# EAGLE design Relay Board V5 (EAGLE 9.6.2)
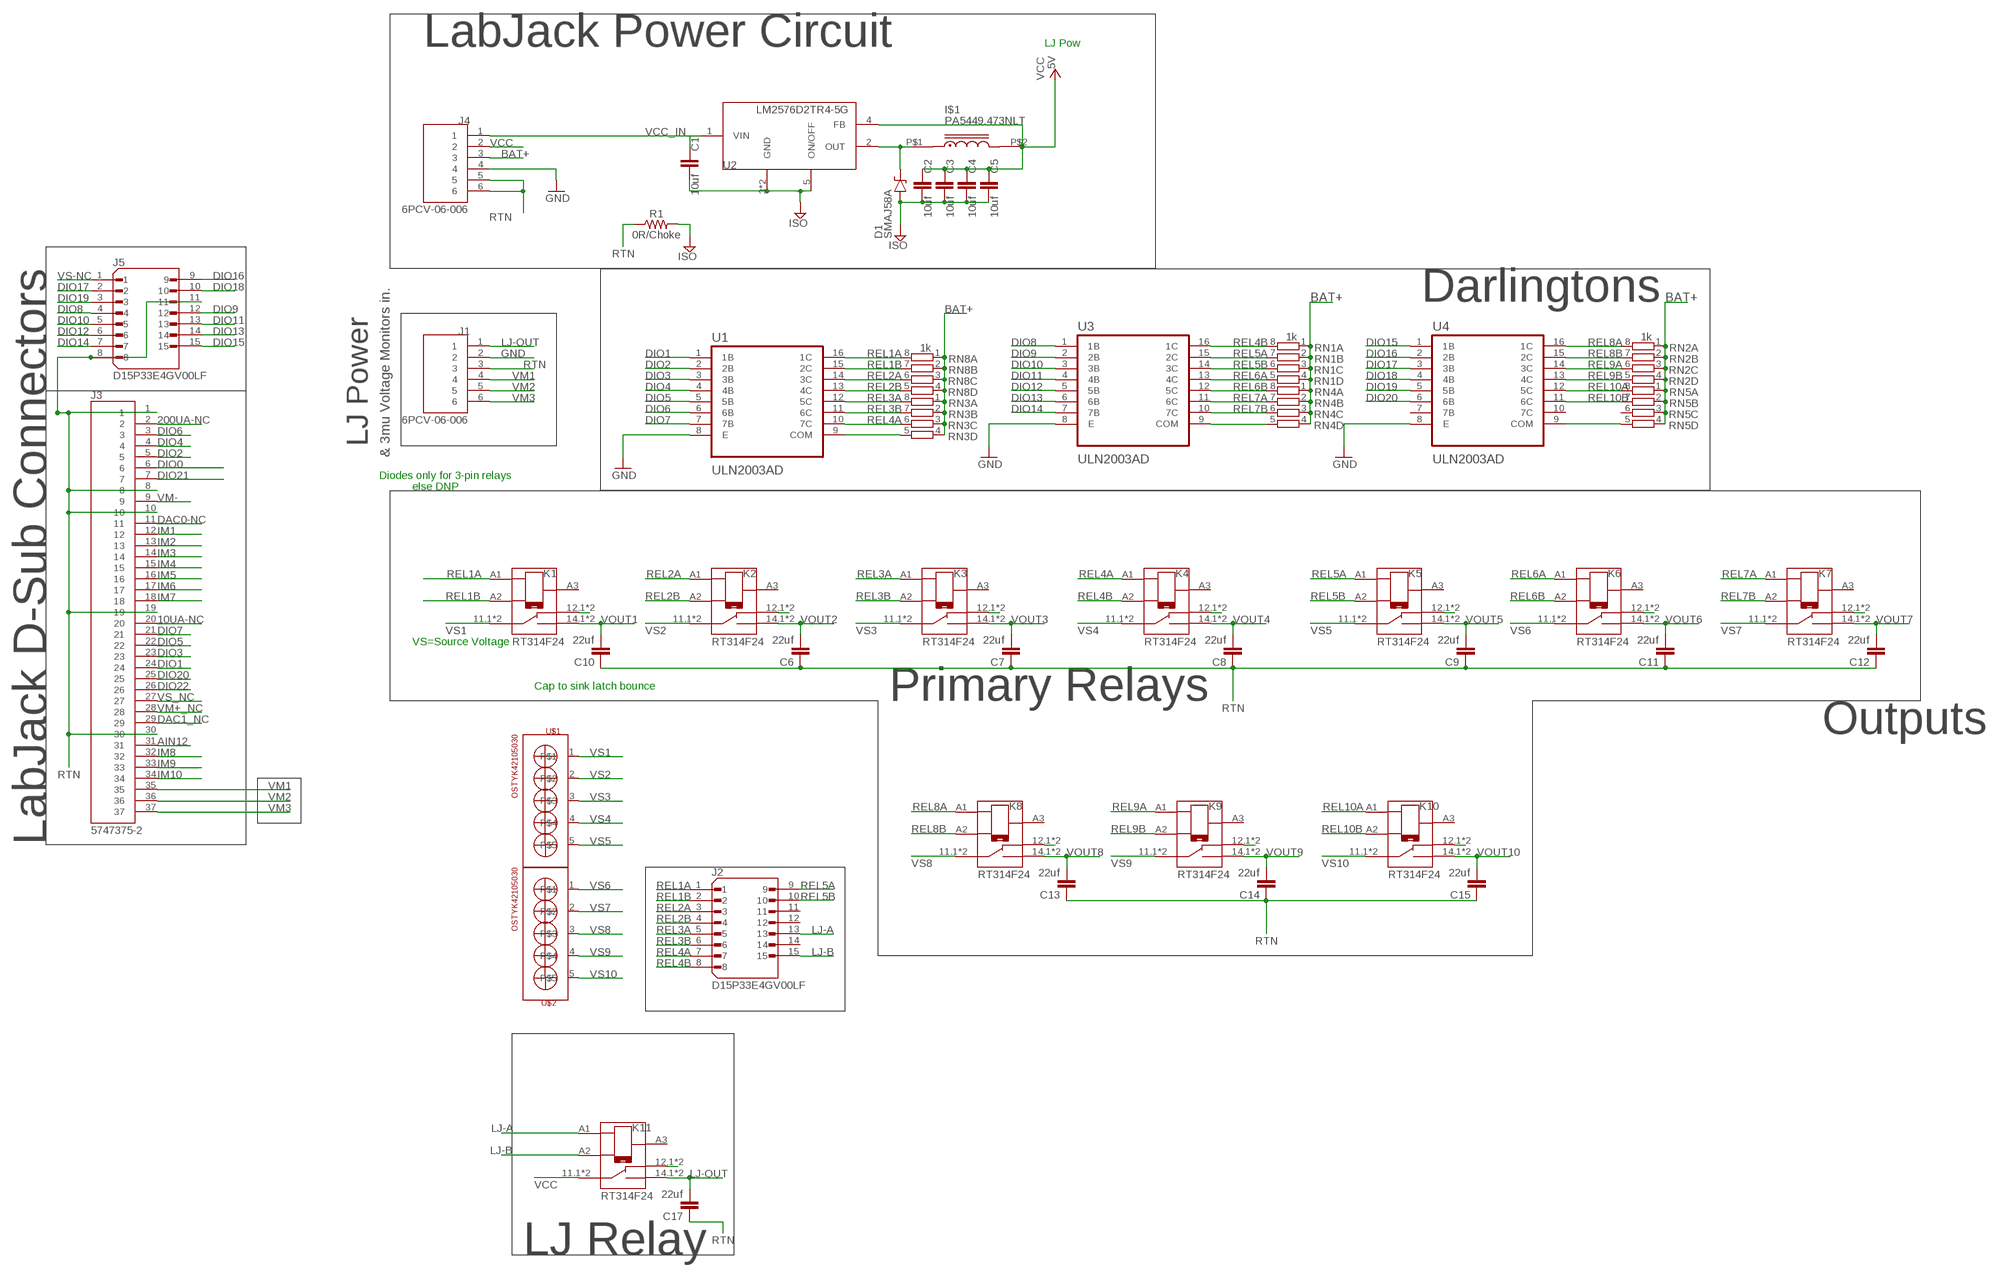
[diagram p0: schematic, sheet 1, part 1 of 2]
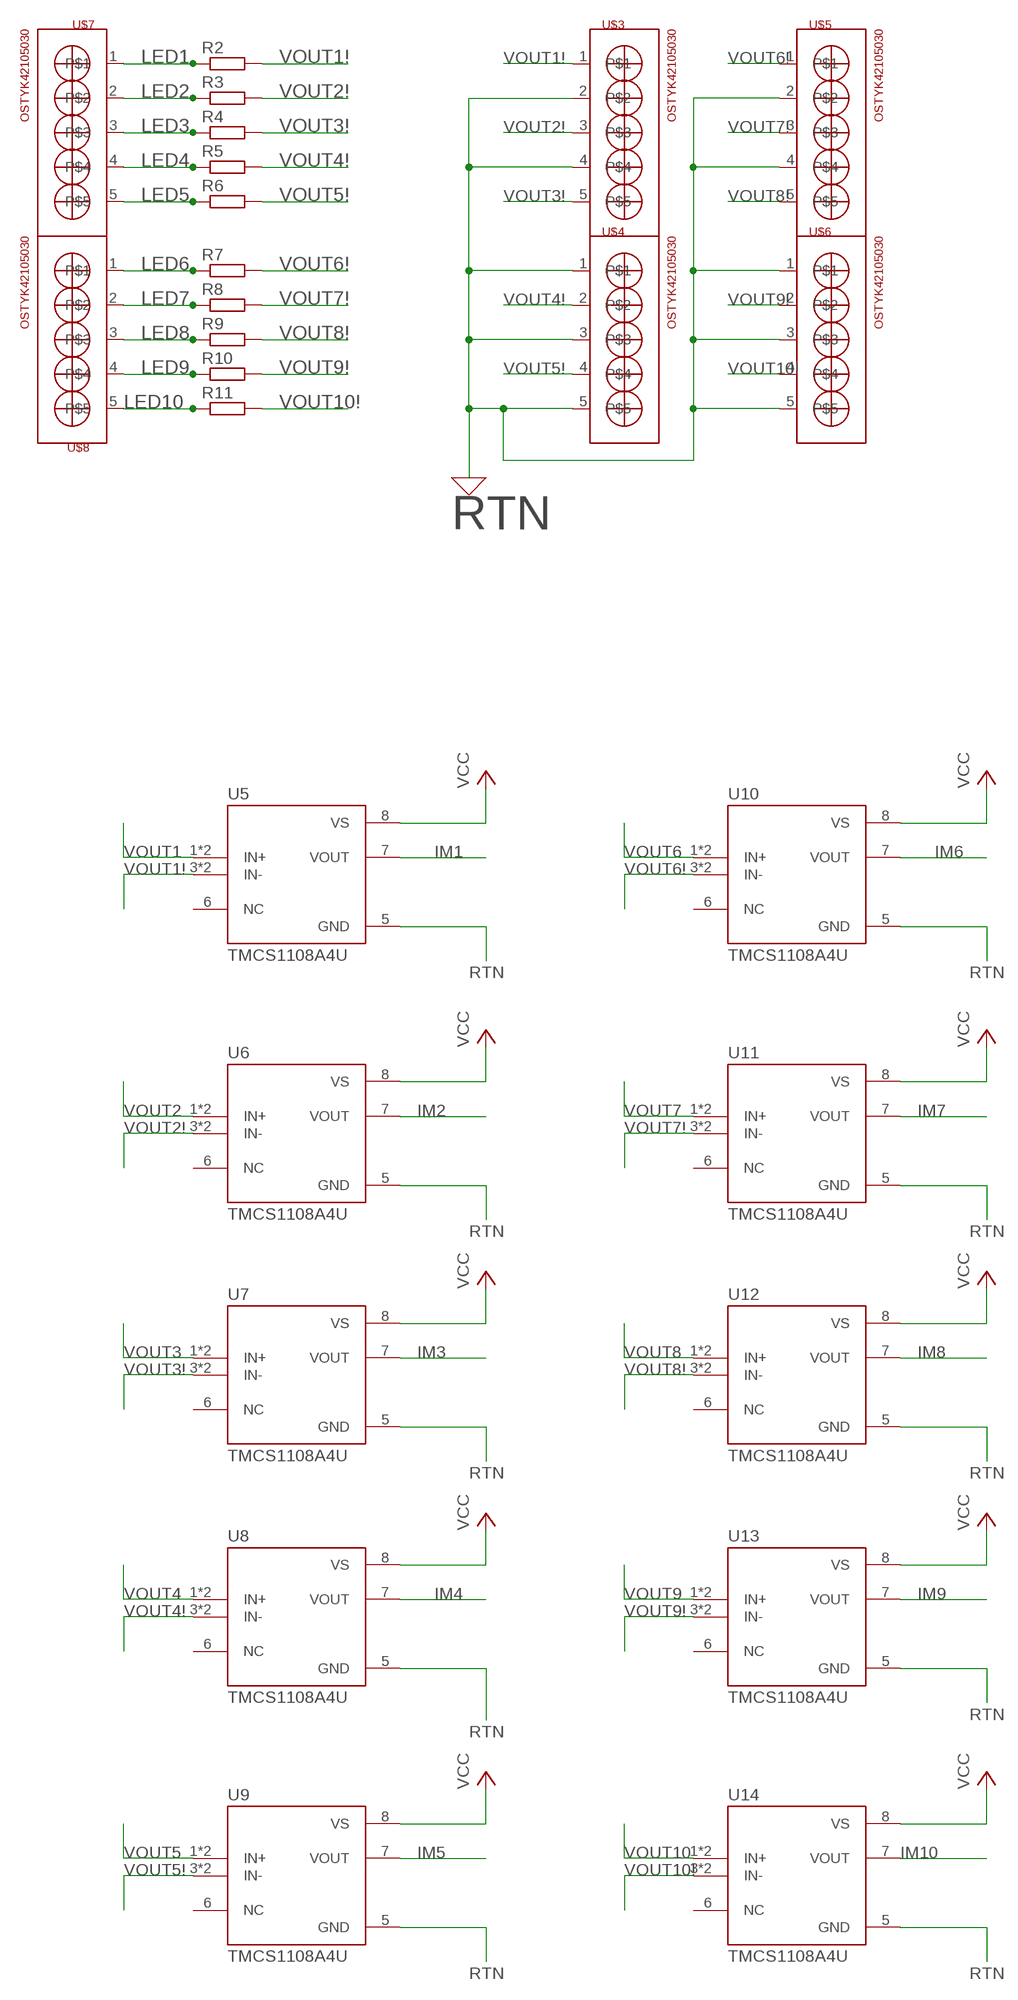
[diagram p1: schematic, sheet 1, part 2 of 2]

## Parts
C1  10uf  39NF-0805-50V-10%  [0805]
C2  10uf  39NF-0805-50V-10%  [0805]
C3  10uf  39NF-0805-50V-10%  [0805]
C4  10uf  39NF-0805-50V-10%  [0805]
C5  10uf  39NF-0805-50V-10%  [0805]
C6  22uf  5.6NF/5600PF_0603_50V_5%  [0603]
C7  22uf  5.6NF/5600PF_0603_50V_5%  [0603]
C8  22uf  5.6NF/5600PF_0603_50V_5%  [0603]
C9  22uf  5.6NF/5600PF_0603_50V_5%  [0603]
C10  22uf  5.6NF/5600PF_0603_50V_5%  [0603]
C11  22uf  5.6NF/5600PF_0603_50V_5%  [0603]
C12  22uf  5.6NF/5600PF_0603_50V_5%  [0603]
C13  22uf  5.6NF/5600PF_0603_50V_5%  [0603]
C14  22uf  5.6NF/5600PF_0603_50V_5%  [0603]
C15  22uf  5.6NF/5600PF_0603_50V_5%  [0603]
C17  22uf  5.6NF/5600PF_0603_50V_5%  [0603]
D1  SMAJ58A  [SMA]
I$1  PA5449.473NLT  PULSE_ELECTRONICS_INDUCTOR  [IND_TYS4020470M-10]
J1  6PCV-06-006  [TE_9-1437652-5]
J2  D15P33E4GV00LF  [AMPHENOL_D15P33E4GV00LF]
J3  5747375-2  [TE_5747375-2]
J4  6PCV-06-006  [TE_9-1437652-5]
J5  D15P33E4GV00LF  [AMPHENOL_D15P33E4GV00LF]
K1  RT314F24  8-1393239-8  [TE_8-1393239-8]
K2  RT314F24  8-1393239-8  [TE_8-1393239-8]
K3  RT314F24  8-1393239-8  [TE_8-1393239-8]
K4  RT314F24  8-1393239-8  [TE_8-1393239-8]
K5  RT314F24  8-1393239-8  [TE_8-1393239-8]
K6  RT314F24  8-1393239-8  [TE_8-1393239-8]
K7  RT314F24  8-1393239-8  [TE_8-1393239-8]
K8  RT314F24  8-1393239-8  [TE_8-1393239-8]
K9  RT314F24  8-1393239-8  [TE_8-1393239-8]
K10  RT314F24  8-1393239-8  [TE_8-1393239-8]
K11  RT314F24  8-1393239-8  [TE_8-1393239-8]
R1  0R/Choke  1.8MOHM  [0603]
R2  R-EU_0204/7  [0204/7]
R3  R-EU_0204/7  [0204/7]
R4  R-EU_0204/7  [0204/7]
R5  R-EU_0204/7  [0204/7]
R6  R-EU_0204/7  [0204/7]
R7  R-EU_0204/7  [0204/7]
R8  R-EU_0204/7  [0204/7]
R9  R-EU_0204/7  [0204/7]
R10  R-EU_0204/7  [0204/7]
R11  R-EU_0204/7  [0204/7]
RN1  1k  0016_064R_10K_/_CAY16-103J4LF  [CAY16]
RN2  1k  0016_064R_10K_/_CAY16-103J4LF  [CAY16]
RN3  1k  0016_064R_10K_/_CAY16-103J4LF  [CAY16]
RN4  1k  0016_064R_10K_/_CAY16-103J4LF  [CAY16]
RN5  1k  0016_064R_10K_/_CAY16-103J4LF  [CAY16]
RN8  1k  0016_064R_10K_/_CAY16-103J4LF  [CAY16]
U1  ULN2003AD  [SOIC127P600X175-16N]
U2  LM2576D2TR4-5G  [D2PAK-5]
U3  ULN2003AD  [SOIC127P600X175-16N]
U4  ULN2003AD  [SOIC127P600X175-16N]
U5  TMCS1108A4U  TMCS1108A3UQDRQ1  [SOIC127P599X175-8N]
U6  TMCS1108A4U  TMCS1108A3UQDRQ1  [SOIC127P599X175-8N]
U7  TMCS1108A4U  TMCS1108A3UQDRQ1  [SOIC127P599X175-8N]
U8  TMCS1108A4U  TMCS1108A3UQDRQ1  [SOIC127P599X175-8N]
U9  TMCS1108A4U  TMCS1108A3UQDRQ1  [SOIC127P599X175-8N]
U10  TMCS1108A4U  TMCS1108A3UQDRQ1  [SOIC127P599X175-8N]
U11  TMCS1108A4U  TMCS1108A3UQDRQ1  [SOIC127P599X175-8N]
U12  TMCS1108A4U  TMCS1108A3UQDRQ1  [SOIC127P599X175-8N]
U13  TMCS1108A4U  TMCS1108A3UQDRQ1  [SOIC127P599X175-8N]
U14  TMCS1108A4U  TMCS1108A3UQDRQ1  [SOIC127P599X175-8N]
U$1  OSTYK42105030  [OSTYK42105030]
U$2  OSTYK42105030  [OSTYK42105030]
U$3  OSTYK42105030  [OSTYK42105030]
U$4  OSTYK42105030  [OSTYK42105030]
U$5  OSTYK42105030  [OSTYK42105030]
U$6  OSTYK42105030  [OSTYK42105030]
U$7  OSTYK42105030  [OSTYK42105030]
U$8  OSTYK42105030  [OSTYK42105030]

## Nets
10UA-NC: J3.20
200UA-NC: J3.2
AGND: C1.2 C2.2 C3.2 C4.2 C5.2 D1.A R1.2 U2.3(GND) U2.5(ON/OFF) U2.6(GND) ; supply symbol labelled ISO
AIN12: J3.31
BAT+: J4.3 RN1.1 RN1.2 RN1.3 RN1.4 RN2.1 RN2.2 RN2.3 RN2.4 RN3.1 RN3.2 RN3.3 RN3.4 RN4.1 RN4.2 RN4.3 RN4.4 RN5.1 RN5.2 RN5.3 RN5.4 RN8.1 RN8.2 RN8.3 RN8.4
DAC0-NC: J3.11
DAC1_NC: J3.29
DIO0: J3.6
DIO1: J3.24 U1.1(1B)
DIO2: J3.5 U1.2(2B)
DIO3: J3.23 U1.3(3B)
DIO4: J3.4 U1.4(4B)
DIO5: J3.22 U1.5(5B)
DIO6: J3.3 U1.6(6B)
DIO7: J3.21 U1.7(7B)
DIO8: J5.4 U3.1(1B)
DIO9: J5.12 U3.2(2B)
DIO10: J5.5 U3.3(3B)
DIO11: J5.13 U3.4(4B)
DIO12: J5.6 U3.5(5B)
DIO13: J5.14 U3.6(6B)
DIO14: J5.7 U3.7(7B)
DIO15: J5.15 U4.1(1B)
DIO16: J5.9 U4.2(2B)
DIO17: J5.2 U4.3(3B)
DIO18: J5.10 U4.4(4B)
DIO19: J5.3 U4.5(5B)
DIO20: J3.25 U4.6(6B)
DIO21: J3.7
DIO22: J3.26
GND: J1.2 J4.4 U1.8(E) U3.8(E) U4.8(E)
IM1: J3.12 U5.7(VOUT)
IM2: J3.13 U6.7(VOUT)
IM3: J3.14 U7.7(VOUT)
IM4: J3.15 U8.7(VOUT)
IM5: J3.16 U9.7(VOUT)
IM6: J3.17 U10.7(VOUT)
IM7: J3.18 U11.7(VOUT)
IM8: J3.32 U12.7(VOUT)
IM9: J3.33 U13.7(VOUT)
IM10: J3.34 U14.7(VOUT)
LED1: R2.1 U$7.1
LED2: R3.1 U$7.2
LED3: R4.1 U$7.3
LED4: R5.1 U$7.4
LED5: R6.1 U$7.5
LED6: R7.1 U$8.1
LED7: R8.1 U$8.2
LED8: R9.1 U$8.3
LED9: R10.1 U$8.4
LED10: R11.1 U$8.5
LJ-A: J2.13 K11.A1
LJ-B: J2.15 K11.A2
LJ-OUT: C17.2 J1.1 K11.14.1 K11.14.2
N$1: K1.12.1 K1.12.2
N$2: RN3.5 U1.9(COM)
N$3: K2.12.1 K2.12.2
N$4: K3.12.1 K3.12.2
N$5: D1.C I$1.P$1 U2.2(OUT)
N$6: K4.12.1 K4.12.2
N$7: K5.12.1 K5.12.2
N$8: K6.12.1 K6.12.2
N$9: K7.12.1 K7.12.2
N$10: RN4.5 U3.9(COM)
N$11: K8.12.1 K8.12.2
N$12: K9.12.1 K9.12.2
N$13: K10.12.1 K10.12.2
N$14: RN5.5 U4.9(COM)
N$15: K11.12.1 K11.12.2
N$16: C1.1
REL1A: J2.1 K1.A1 RN8.8 U1.16(1C)
REL1B: J2.2 K1.A2 RN8.7 U1.15(2C)
REL2A: J2.3 K2.A1 RN8.6 U1.14(3C)
REL2B: J2.4 K2.A2 RN8.5 U1.13(4C)
REL3A: J2.5 K3.A1 RN3.8 U1.12(5C)
REL3B: J2.6 K3.A2 RN3.7 U1.11(6C)
REL4A: J2.7 K4.A1 RN3.6 U1.10(7C)
REL4B: J2.8 K4.A2 RN1.8 U3.16(1C)
REL5A: J2.9 K5.A1 RN1.7 U3.15(2C)
REL5B: J2.10 K5.A2 RN1.6 U3.14(3C)
REL6A: K6.A1 RN1.5 U3.13(4C)
REL6B: K6.A2 RN4.8 U3.12(5C)
REL7A: K7.A1 RN4.7 U3.11(6C)
REL7B: K7.A2 RN4.6 U3.10(7C)
REL8A: K8.A1 RN2.8 U4.16(1C)
REL8B: K8.A2 RN2.7 U4.15(2C)
REL9A: K9.A1 RN2.6 U4.14(3C)
REL9B: K9.A2 RN2.5 U4.13(4C)
REL10A: K10.A1 RN5.8 U4.12(5C)
REL10B: K10.A2 RN5.7 U4.11(6C)
RTN: C6.1 C7.1 C8.1 C9.1 C10.1 C11.1 C12.1 C13.1 C14.1 C15.1 C17.1 J1.3 J3.1 J3.8 J3.10 J3.19 J3.30 J4.5 J4.6 J5.8 J5.11 R1.1 U5.5(GND) U6.5(GND) U7.5(GND) U8.5(GND) U9.5(GND) U10.5(GND) U11.5(GND) U12.5(GND) U13.5(GND) U14.5(GND) U$3.2 U$3.4 U$4.1 U$4.3 U$4.5 U$5.2 U$5.4 U$6.1 U$6.3 U$6.5
VCC: C2.1 C3.1 C4.1 C5.1 I$1.P$2 J4.2 K11.11.1 K11.11.2 U2.4(FB) U5.8(VS) U6.8(VS) U7.8(VS) U8.8(VS) U9.8(VS) U10.8(VS) U11.8(VS) U12.8(VS) U13.8(VS) U14.8(VS)
VCC_IN: J4.1 U2.1(VIN)
VM1: J1.4 J3.35
VM2: J1.5 J3.36
VM3: J1.6 J3.37
VM+_NC: J3.28
VM-: J3.9
VOUT1: C10.2 K1.14.1 K1.14.2 U5.1(IN+) U5.2(IN+)
VOUT1!: R2.2 U5.3(IN-) U5.4(IN-) U$3.1
VOUT2: C6.2 K2.14.1 K2.14.2 U6.1(IN+) U6.2(IN+)
VOUT2!: R3.2 U6.3(IN-) U6.4(IN-) U$3.3
VOUT3: C7.2 K3.14.1 K3.14.2 U7.1(IN+) U7.2(IN+)
VOUT3!: R4.2 U7.3(IN-) U7.4(IN-) U$3.5
VOUT4: C8.2 K4.14.1 K4.14.2 U8.1(IN+) U8.2(IN+)
VOUT4!: R5.2 U8.3(IN-) U8.4(IN-) U$4.2
VOUT5: C9.2 K5.14.1 K5.14.2 U9.1(IN+) U9.2(IN+)
VOUT5!: R6.2 U9.3(IN-) U9.4(IN-) U$4.4
VOUT6: C11.2 K6.14.1 K6.14.2 U10.1(IN+) U10.2(IN+)
VOUT6!: R7.2 U10.3(IN-) U10.4(IN-) U$5.1
VOUT7: C12.2 K7.14.1 K7.14.2 U11.1(IN+) U11.2(IN+)
VOUT7!: R8.2 U11.3(IN-) U11.4(IN-) U$5.3
VOUT8: C13.2 K8.14.1 K8.14.2 U12.1(IN+) U12.2(IN+)
VOUT8!: R9.2 U12.3(IN-) U12.4(IN-) U$5.5
VOUT9: C14.2 K9.14.1 K9.14.2 U13.1(IN+) U13.2(IN+)
VOUT9!: R10.2 U13.3(IN-) U13.4(IN-) U$6.2
VOUT10: C15.2 K10.14.1 K10.14.2 U14.1(IN+) U14.2(IN+)
VOUT10!: R11.2 U14.3(IN-) U14.4(IN-) U$6.4
VS1: K1.11.1 K1.11.2 U$1.1
VS2: K2.11.1 K2.11.2 U$1.2
VS3: K3.11.1 K3.11.2 U$1.3
VS4: K4.11.1 K4.11.2 U$1.4
VS5: K5.11.1 K5.11.2 U$1.5
VS6: K6.11.1 K6.11.2 U$2.1
VS7: K7.11.1 K7.11.2 U$2.2
VS8: K8.11.1 K8.11.2 U$2.3
VS9: K9.11.1 K9.11.2 U$2.4
VS10: K10.11.1 K10.11.2 U$2.5
VS-NC: J5.1
VS_NC: J3.27
Unconnected: J2.11 J2.12 J2.14 K1.A3 K2.A3 K3.A3 K4.A3 K5.A3 K6.A3 K7.A3 K8.A3 K9.A3 K10.A3 K11.A3 RN5.6 U4.7(7B) U4.10(7C) U5.6(NC) U6.6(NC) U7.6(NC) U8.6(NC) U9.6(NC) U10.6(NC) U11.6(NC) U12.6(NC) U13.6(NC) U14.6(NC)

## Notes on the sheet
- LabJack Power Circuit | LJ Pow
- 5V
- LabJack D-Sub Connectors
- Darlingtons
- LJ Power
- & 3mu Voltage Monitors in.
- Diodes only for 3-pin relays
- else DNP
- VS=Source Voltage
- Cap to sink latch bounce
- Primary Relays | Outputs
- LJ Relay

## Library data of the parts
C1-C5 = SparkFun-Capacitors:39NF: 39nF ceramic capacitors A capacitor is a passive two-terminal electrical component used to store electrical energy temporarily in an electric field.; PROD_ID: CAP-15816; VALUE: 39nF
C6-C15 C17 = SparkFun-Capacitors:5.6NF/5600PF: 5.6nF/5600pF ceramic capacitors A capacitor is a passive two-terminal electrical component used to store electrical energy temporarily in an electric field.; PROD_ID: CAP-16058; VALUE: 5.6nF
D1 = SMAJ58A:SMAJ58A: Check prices <https://pricing.snapeda.com/parts/SMAJ58A/Littelfuse%20Inc./view-part?ref=eda>; AVAILABILITY: Good; DESCRIPTION: 93.6V Clamp 4.3A Ipp Tvs Diode Surface Mount DO-214AC (SMA); MF: Littelfuse Inc.; MP: SMAJ58A; PACKAGE: DO-214AC-214 Littelfuse Inc.; PRICE: None; PURCHASE-URL: https://pricing.snapeda.com/search/part/SMAJ58A/?ref=eda
I$1 = pulse_electronics_inductor:PULSE_ELECTRONICS_INDUCTOR
J1 J4 = 6PCV-06-006:6PCV-06-006: Check availability <https://pricing.snapeda.com/parts/6PCV-06-006/TE%20Connectivity/view-part?ref=eda>; AVAILABILITY: In Stock; COMMENT: 9-1437652-5; DESCRIPTION: Buchanan 6 Position 9.53 mm Pitch Single Row 12-22 AWG Tri-Barrier Strip; MF: TE Connectivity; MP: 6PCV-06-006; PACKAGE: None; PRICE: None; PURCHASE-URL: https://pricing.snapeda.com/search/part/6PCV-06-006/?ref=eda
J2 J5 = D15P33E4GV00LF:D15P33E4GV00LF: 15 Position D-Sub Plug, Male Pins Connector Check availability <https://pricing.snapeda.com/parts/D15P33E4GV00LF/Amphenol%20ICC/view-part?ref=eda>; AVAILABILITY: In Stock; DESCRIPTION: D-Sub Standard Board Mount Connector, Input Output Connectors, Signal 15 way Pin Right Angle, Solder US standard, 200 cycles, Harpoons + Female Screw UNC 4 - 40 + Elec cont., 1.6mm PCB thickness.; MF: Amphenol ICC; MP: D15P33E4GV00LF; PACKAGE: None; PRICE: None; PURCHASE-URL: https://pricing.snapeda.com/search/part/D15P33E4GV00LF/?ref=eda
J3 = db37:5747375-2: onn D-Subminiature PIN 37 POS 2.77mm Solder ST Thru-Hole 37 Terminal 1 Port Tube; COMMENT: 5747375-2; DESCRIPTION: D-SUB pin strip 180 ° Number of pins: 37 Print TE Connectivity AMPLIMITE HD-20 1 pc(s); DIGI-KEY_PART_NUMBER: A34071-ND; EU_ROHS_COMPLIANCE: Compliant; MF: TE Connectivity; MP: 5747375-2; PACKAGE: None; PURCHASE-URL: https://pricing.snapeda.com/search/part/5747375-2/?ref=eda
K1-K11 = 8-1393239-8:8-1393239-8: General Purpose Relay SPDT (1 Form C) 24VDC Coil Through Hole Check prices <https://pricing.snapeda.com/parts/RT314F24/TE%20Connectivity/view-part?ref=eda>; AVAILABILITY: In Stock; COMMENT: 8-1393239-8; DESCRIPTION: General Purpose Relay, Power PCB Relay RT1 Series, Power, Latching Dual Coil, SPDT, 24 VDC, 16 A; MF: TE Connectivity; MP: RT314F24; PACKAGE: None; PRICE: None; PURCHASE-URL: https://pricing.snapeda.com/search/part/RT314F24/?ref=eda
R1 = SparkFun-Resistors:1.8MOHM: 1.8 MOhms ±5% 0.1W, 1/10W Chip Resistor 0603; PROD_ID: RES-13994; VALUE: 1.8M
R2-R11 = rcl:R-EU_: RESISTOR, European symbol; SPICEPREFIX: R
RN1-RN5 RN8 = Resistenze:0016_064R_10K_/_CAY16-103J4LF: 10K 064 R; CASE: SMD_3,2x1,6; MONTHLY_USAGE: _____; PART_NUMBER: 064R_10K_/_CAY16-103J4LF; PRICE: _____; SUPPLIER: _____; TYPE: Resistenze; VALUE: 10k
U1 U3 U4 = ULN2003AD:ULN2003AD: Check availability <https://pricing.snapeda.com/parts/ULN2003AD/Texas%20Instruments/view-part?ref=eda>; AVAILABILITY: In Stock; DESCRIPTION: 50-V, 7-ch darlington transistor array, -20C to 70C; MF: Texas Instruments; MP: ULN2003AD; PACKAGE: SOIC-16 Texas Instruments; PRICE: None; PURCHASE-URL: https://pricing.snapeda.com/search/part/ULN2003AD/?ref=eda
U2 = LM2576D2TR4-5G:LM2576D2TR4-5G: http://octopart.com/lm2576d2tr4-5g-on+semiconductor-46514222 Check prices <https://pricing.snapeda.com/parts/LM2576D2TR4-5G/ON%20Semiconductor/view-part?ref=eda>; AVAILABILITY: In Stock; DESCRIPTION: Buck Switching Regulator IC Positive or Negative Fixed 5V 1 Output 3A TO-263-6, D²Pak (5 Leads + Tab), TO-263BA; MF: ON Semiconductor; MP: LM2576D2TR4-5G; PACKAGE: D2PAK-5 ON Semiconductor; PRICE: None; PURCHASE-URL: https://pricing.snapeda.com/search/part/LM2576D2TR4-5G/?ref=eda
U5-U14 = TMCS1108A3UQDRQ1:TMCS1108A3UQDRQ1: Check availability <https://pricing.snapeda.com/parts/TMCS1108A3UQDRQ1/Texas%20Instruments/view-part?ref=eda>; AVAILABILITY: In Stock; DESCRIPTION: AEC-Q100, ±100-V isolated Hall-effect current sensor with internal reference; MF: Texas Instruments; MP: TMCS1108A3UQDRQ1; PACKAGE: None; PRICE: None; PURCHASE-URL: https://pricing.snapeda.com/search/part/TMCS1108A3UQDRQ1/?ref=eda
U$1-U$8 = OSTYK42105030:OSTYK42105030: Check availability <https://pricing.snapeda.com/parts/OSTYK42105030/On%20Shore%20Technology%20Inc./view-part?ref=eda>; AVAILABILITY: In Stock; DESCRIPTION: 5 Circuit 0.325 (8.26mm) Barrier Block Connector, Screws with Captive Plate; MF: On Shore Technology Inc.; MP: OSTYK42105030; PACKAGE: None; PRICE: None; PURCHASE-URL: https://pricing.snapeda.com/search/part/OSTYK42105030/?ref=eda

## Board
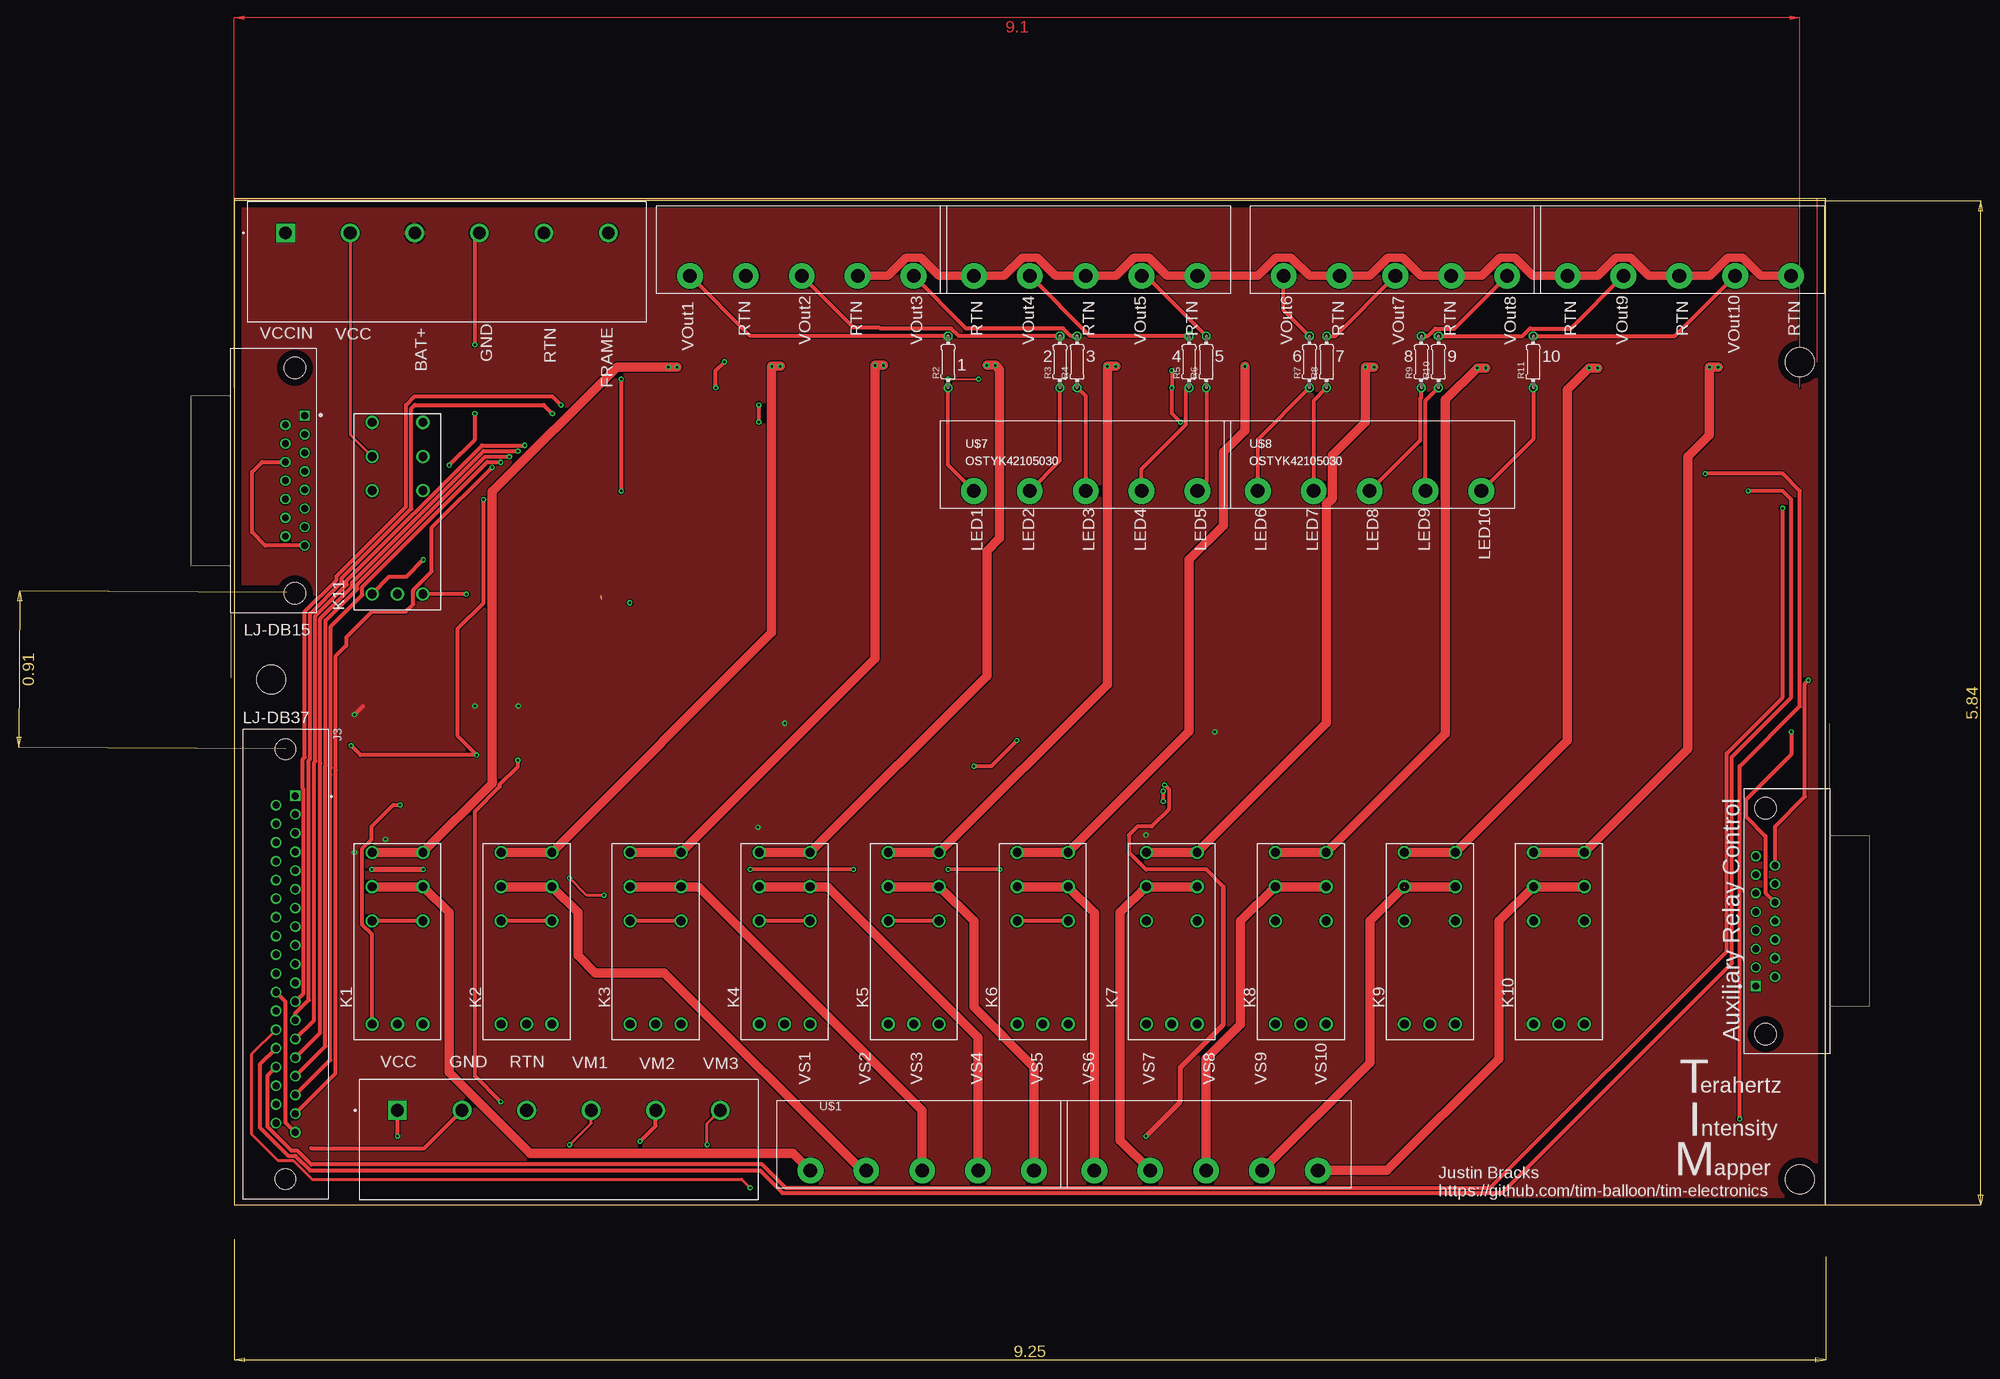
[diagram p2: board, top side]
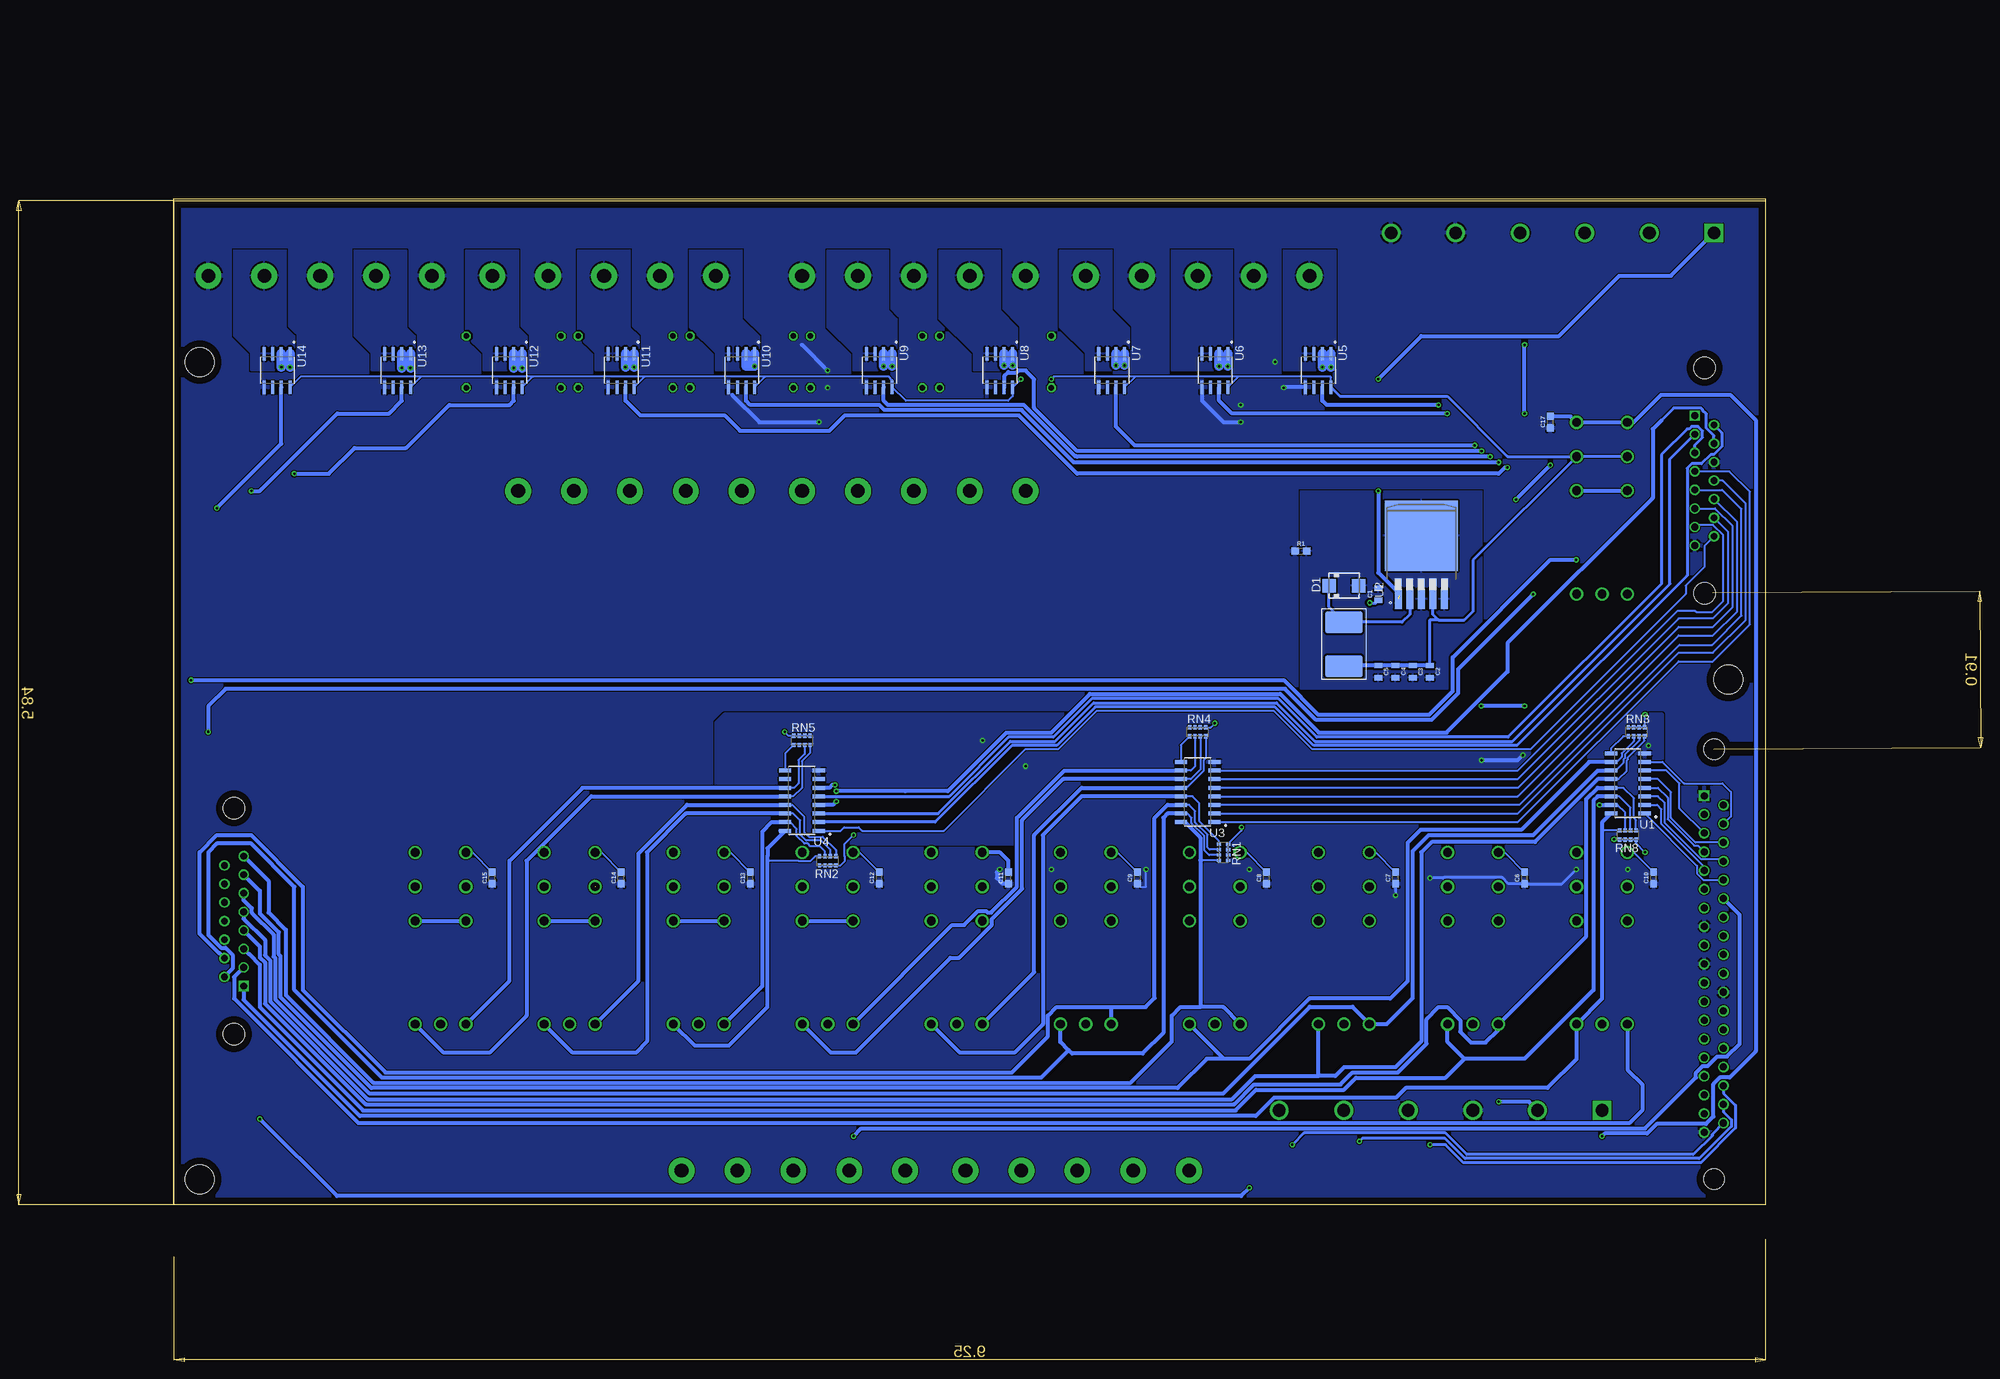
[diagram p3: board, bottom side, seen from below]

Size 234.95 x 148.59 mm. Coordinates in mm from the lower left corner, seen from the top.
Outline: 0,0 234.93,0 234.93,148.26 0,148.26
Outline: 0,0 0,148.59 234.95,148.59 234.95,0 0,0
Copper layers (1*16): Top 0.035mm / dielectric 1.5mm / Bottom 0.035mm
Design rules "default": minimum track width 6mil, minimum drill 0.35mm, track to track 6mil, track to pad 6mil, pad to pad 6mil, via to via 6mil, smd to smd 6mil, copper to edge 40mil, drill to drill 6mil, minimum pad ring 10mil, minimum via ring 8mil, stop-mask expansion 4mil, vias tented up to drill 0mil, thermal gap 10mil
Holes 4.32 mm at 231.14,3.81 231.14,124.46 5.46,77.6

### Footprints (pad centres in the part's own frame; a part is rotated, then mirrored left to right if it is on the bottom)
0805 = smd 0.8 x 1.2: 1 -0.9,0; 2 0.9,0
0603 = smd 1.1 x 1: 1 -0.85,0; 2 0.85,0
SMA = smd 2 x 2: A 2.2,0; C -2.2,0
IND_TYS4020470M-10 = smd 3.2 x 5.5: P$1 -3.5,0; P$2 3,0
TE_9-1437652-5 = drill 1.854 pad 2.204 square: 1 0,0 | drill 1.854 pad 2.204: 2 9.53,0; 3 19.06,0; 4 28.59,0; 5 38.12,0; 6 47.65,0
AMPHENOL_D15P33E4GV00LF = drill 1 square: 1 -9.59,1.42 | drill 1: 2 -6.85,1.42; 3 -4.11,1.42; 4 -1.37,1.42; 5 1.37,1.42; 6 4.11,1.42; 7 6.85,1.42; 8 9.59,1.42; 9 -8.22,-1.42; 10 -5.48,-1.42; 11 -2.74,-1.42; 12 0,-1.42; 13 2.74,-1.42; 14 5.48,-1.42; 15 8.22,-1.42 | hole 3.2: -16.66,0; 16.66,0
TE_5747375-2 = drill 1.04 square: 1 -24.84,1.42 | drill 1.04: 2 -22.1,1.42; 3 -19.33,1.42; 4 -16.56,1.42; 5 -13.82,1.42; 6 -11.05,1.42; 7 -8.28,1.42; 8 -5.54,1.42; 9 -2.77,1.42; 10 0,1.42; 11 2.77,1.42; 12 5.54,1.42; 13 8.28,1.42; 14 11.05,1.42; 15 13.82,1.42; 16 16.56,1.42; 17 19.33,1.42; 18 22.1,1.42; 19 24.84,1.42; 20 -23.47,-1.42; 21 -20.7,-1.42; 22 -17.96,-1.42; 23 -15.19,-1.42; 24 -12.42,-1.42; 25 -9.68,-1.42; 26 -6.91,-1.42; 27 -4.14,-1.42; 28 -1.4,-1.42; 29 1.4,-1.42; 30 4.14,-1.42; 31 6.91,-1.42; 32 9.68,-1.42; 33 12.42,-1.42; 34 15.19,-1.42; 35 17.96,-1.42; 36 20.7,-1.42; 37 23.47,-1.42 | hole 3.05: -31.75,0; 31.75,0
TE_8-1393239-8 = drill 1.3: 11.1 0,-3.75; 11.2 0,3.75; 12.1 -5.04,-3.75; 12.2 -5.04,3.75; 14.1 5.04,-3.75; 14.2 5.04,3.75; A1 -20.3,-3.75; A2 -20.3,3.75; A3 -20.3,0
0204/7 = drill 0.813 octagon: 1 -3.81,0; 2 3.81,0
CAY16 = smd 0.5 x 0.65: 1 -1.2,-0.675; 2 -0.4,-0.675; 3 0.4,-0.675; 4 1.2,-0.675; 5 1.2,0.675; 6 0.4,0.675; 7 -0.4,0.675; 8 -1.2,0.675
SOIC127P600X175-16N = smd 1.97 x 0.6: 1 -2.475,4.445; 2 -2.475,3.175; 3 -2.475,1.905; 4 -2.475,0.635; 5 -2.475,-0.635; 6 -2.475,-1.905; 7 -2.475,-3.175; 8 -2.475,-4.445; 9 2.475,-4.445; 10 2.475,-3.175; 11 2.475,-1.905; 12 2.475,-0.635; 13 2.475,0.635; 14 2.475,1.905; 15 2.475,3.175; 16 2.475,4.445
D2PAK-5 = smd 3 x 1.067: 1 -4.521,3.404; 2 -4.521,1.702; 3 -4.521,0; 4 -4.521,-1.702; 5 -4.521,-3.404 | smd 10.41 x 10.8: 6 4.81,0
SOIC127P599X175-8N = smd 1.97 x 0.6: 1 -2.47,1.905; 2 -2.47,0.635; 3 -2.47,-0.635; 4 -2.47,-1.905; 5 2.47,-1.905; 6 2.47,-0.635; 7 2.47,0.635; 8 2.47,1.905
OSTYK42105030 = drill 2 pad 3.81: 1 -16.51,0; 2 -8.26,0; 3 -0.01,0; 4 8.24,0; 5 16.49,0

### Placement (x,y rotation side)
C1  57.15,90.17 90 bottom
C2  49.53,78.74 270 bottom
C3  52.07,78.74 270 bottom
C4  54.61,78.74 270 bottom
C5  57.15,78.74 270 bottom
C6  35.56,48.26 90 bottom
C7  54.61,48.26 90 bottom
C8  73.66,48.26 90 bottom
C9  92.71,48.26 90 bottom
C10  16.51,48.26 90 bottom
C11  111.76,48.26 90 bottom
C12  130.81,48.26 90 bottom
C13  149.86,48.26 90 bottom
C14  168.91,48.26 90 bottom
C15  187.96,48.26 90 bottom
C17  31.75,115.57 90 bottom
D1  62.23,91.44 0 bottom
I$1  62.23,82.55 270 bottom
J1  24.13,13.97 0 top
J2  226.06,41.91 90 top
J3  7.62,35.56 270 top
J4  7.62,143.51 0 top
J5  9.02,106.93 270 top
K1  24.13,46.99 90 top
K2  43.18,46.99 90 top
K3  62.23,46.99 90 top
K4  81.28,46.99 90 top
K5  100.33,46.99 90 top
K6  119.38,46.99 90 top
K7  138.43,46.99 90 top
K8  157.48,46.99 90 top
K9  176.53,46.99 90 top
K10  195.58,46.99 90 top
K11  24.13,110.49 90 top
R1  68.58,96.52 0 bottom
R2  105.41,124.46 90 top
R3  121.92,124.46 90 top
R4  124.46,124.46 90 top
R5  140.97,124.46 90 top
R6  143.51,124.46 90 top
R7  158.75,124.46 90 top
R8  161.29,124.46 90 top
R9  175.26,124.46 90 top
R10  177.8,124.46 90 top
R11  191.77,124.46 90 top
RN1  80.01,52.07 90 bottom
RN2  138.43,50.8 0 bottom
RN3  19.05,69.85 180 bottom
RN4  83.82,69.85 180 bottom
RN5  142.24,68.58 180 bottom
RN8  20.32,54.61 0 bottom
U1  20.32,62.23 180 bottom
U2  50.8,93.98 90 bottom
U3  83.82,60.96 180 bottom
U4  142.24,59.69 180 bottom
U5  66.04,123.19 270 bottom
U6  81.28,123.19 270 bottom
U7  96.52,123.19 270 bottom
U8  113.03,123.19 270 bottom
U9  130.81,123.19 270 bottom
U10  151.13,123.19 270 bottom
U11  168.91,123.19 270 bottom
U12  185.42,123.19 270 bottom
U13  201.93,123.19 270 bottom
U14  219.71,123.19 270 bottom
U$1  101.6,5.08 0 top
U$2  143.51,5.08 0 top
U$3  83.82,137.16 0 top
U$4  125.73,137.16 0 top
U$5  171.45,137.16 0 top
U$6  213.36,137.16 0 top
U$7  125.73,105.41 0 top
U$8  167.64,105.41 0 top

### Tracks (layer width: path | path; a pad name or v marks a point on that pad's centre or on a via)
AGND
  pour Bottom (isolate 0.305): 41.91,105.41 41.91,76.2 68.58,76.2 68.58,105.41
BAT+  (via drill 0.35)
  Top 0.61: v17.78,72.39 19.05,73.66
  Bottom 0.305: RN3.4 RN3.3 RN3.2 RN3.1 17.78,70.59 v17.78,72.39 | RN4.4 RN4.3 RN4.2 RN4.1 81.88,70.53 v81.28,71.12 | RN1.1 RN1.2 RN1.3 RN1.4 77.34,55.26 v77.34,55.75 | v17.78,52.07 19.12,53.41 RN8.4 RN8.3 RN8.2 RN8.1 22.31,53.94 v22.35,53.98 | RN5.1 RN5.2 RN5.3 RN5.4 144.19,69.25 v144.78,69.85 | RN2.1 RN2.2 RN2.3 RN2.4 136.56,50.12 135.89,50.8 135.89,51.43 135.96,51.5 135.96,53.27 v134.62,54.61
  Bottom 0.61: v35.56,73.66 v41.96,73.66
  pour Top (rank 6): -3.81,154.94 240.03,154.94 240.03,-5.08 -3.81,-5.08
DIO1
  Bottom 0.305: U1.1 10.12,50.06 10.12,48.93 9.17,47.98 J3.24
DIO2
  Bottom 0.305: U1.2 15.98,59.05 15.34,58.42 15.34,56.24 9.04,49.94 J3.5
DIO3
  Bottom 0.305: J3.23 6.49,51.03 9.49,51.03 14.88,56.43 14.88,59.33 15.88,60.33 U1.3
DIO4
  Bottom 0.305: U1.4 15.88,61.59 14.43,60.15 14.43,56.96 10.53,53.06 9.98,53.06 J3.4
DIO5
  Bottom 0.305: J3.22 10.34,53.52 13.97,57.15 13.97,60.96 15.88,62.87 U1.5
DIO6
  Bottom 0.305: J3.3 12.7,58.55 12.7,62.23 14.61,64.14 U1.6
DIO7
  Bottom 0.305: J3.21 5.12,57.34 5.12,60.99 6.35,62.23 12.05,62.23 15.23,65.41 U1.7
DIO8
  Bottom 0.305: U3.1 36.58,56.52 12.83,80.26 7.75,80.26 2.29,85.72 2.29,105.28 5.31,108.3 J5.4
DIO9
  Bottom 0.305: U3.2 36.58,57.78 12.83,81.53 7.75,81.53 2.92,86.36 2.92,103.53 6.33,106.93 J5.12
DIO10
  Bottom 0.305: J5.5 6.38,105.56 3.56,102.74 3.56,87 7.88,82.68 12.7,82.68 36.32,59.05 U3.3
DIO11
  Bottom 0.305: U3.4 36.58,60.33 12.83,84.07 7.75,84.07 4.19,87.63 4.19,100.79 J5.13
DIO12
  Bottom 0.305: J5.6 7.45,102.82 4.85,100.23 4.85,88.24 7.75,85.34 12.83,85.34 36.58,61.59 U3.5
DIO13
  Bottom 0.305: U3.6 36.58,62.87 12.83,86.61 7.75,86.61 5.59,88.77 5.59,99.44 J5.14
DIO14
  Bottom 0.305: U3.7 36.58,64.14 12.96,87.76 10.41,87.76 10.16,87.51 7.87,87.51 6.25,89.13 6.25,98.9 7.75,100.39 10.13,100.39 J5.7
DIO15
  Bottom 0.305: J5.15 9.02,97.29 9.02,94.19 11.79,91.42 11.79,90.2 34.67,67.31 66.95,67.31 72.64,73 98.71,73 104.4,67.31 109.22,67.31 121.28,55.24 133.35,55.24 133.86,55.75 136.02,55.75 136.53,55.24 U4.1
DIO16
  Bottom 0.457: J5.9 6.46,114.02 6.46,111.94 7.6,110.81 8.07,110.81 9.44,109.44 10.91,109.44 11.57,108.77 11.57,92.95 36.68,67.84 66.73,67.84 72.42,73.53 98.93,73.53 104.62,67.84 111.23,67.84 122.56,56.52 U4.2
DIO17
  Bottom 0.457: U4.3 122.15,57.78 111.48,68.45 104.87,68.45 99.18,74.14 72.17,74.14 66.47,68.45 37.34,68.45 14.1,91.69 14.1,110.12 J5.2
DIO18  (via drill 0.35)
  Top 0.61: v137.16,61.08 v137.16,59.57
  Bottom 0.457: J5.10 7.6,113.55 8.73,114.68 8.73,116.81 9.3,117.38 9.3,117.44 9.53,117.66 13.53,117.66 15.37,115.82
  Bottom 0.61: 15.37,115.82 16.64,114.55 16.64,104.39 38.1,82.93 38.1,78.74 47.09,69.75 65.94,69.75 71.63,75.44 99.72,75.44 105.41,69.75 112.02,69.75 120.68,61.08 127,61.08 v137.16,61.08 | v137.16,59.57 137.67,59.05 U4.4
DIO19
  Bottom 0.457: J5.3 10.44,112.18 9.3,113.31 9.3,114.25 9.97,114.92 10.91,114.92 11.27,114.55 11.56,114.55 15.37,110.74 15.37,91.69 38,69.06 66.22,69.06 71.91,74.75 99.44,74.75 105.13,69.06 111.73,69.06 120.47,60.33 U4.5
DIO20  (via drill 0.35)
  Top 0.61: v137.38,62.02 137.47,61.92 137.51,61.92 138,61.43 138,58.42 135.46,55.88 133.35,55.88 132.08,54.61 132.08,52.07 134.62,49.53 143.51,49.53 146.05,46.99
  Top 0.711: v134.62,10.16 139.7,15.24 139.7,20.32 146.05,26.67 146.05,46.99
  Bottom 0.61: v134.62,10.16 133.48,11.3 17.79,11.3 10.28,18.82 10.28,19.51 9.29,20.5 8.53,20.5 7.13,21.9 5.69,21.9 3.81,23.78 3.81,42.85 J3.25 | v137.38,62.02 137.76,62.02 138.18,61.59 U4.6
GND  (via drill 0.35)
  Top 0.61: J1.2 28.07,8.38 11.38,8.38 | v115.57,68.58 111.76,64.77 v109.22,64.77 | v39.37,15.24 35.56,19.05 35.56,58.09 39.24,61.78 39.24,62.1 41.91,64.77 v41.91,65.66 | v17.27,67.82 18.67,66.42 v35.81,66.42 33.02,69.22 33.02,85.09 36.83,88.9 v36.83,104.14 | v31.75,109.22 35.56,113.03 v35.56,116.84 | v35.56,127 35.56,142.86 J4.4
  Bottom 0.61: J1.2 34.93,15.24 v39.37,15.24 | v41.91,65.66 36.58,65.66 v35.81,66.42 | v36.83,104.14 v31.75,109.22 | v35.56,116.84 v35.56,127
  pour Bottom: 154.94,71.12 154.94,53.34 22.86,53.34 15.24,60.96 15.24,72.39 153.67,72.39
IM1  (via drill 0.35)
  Top 0.61: J3.12 10.28,31.26 10.28,61.37 10.16,61.49 10.16,65.83 10.47,66.13 10.47,87.59 15.14,92.26 15.14,92.84 25.4,103.1 25.4,118.11 26.67,119.38 46.99,119.38 v48.26,118.11
  Bottom 0.61: U5.7 65.41,118.75 64.77,118.11 v48.26,118.11
IM2  (via drill 0.35)
  Top 0.61: J3.13 9.04,28.27 11.04,30.27 11.04,65.63 11.23,65.82 11.23,87.28 15.9,91.95 15.9,92.52 26.16,102.78 26.16,117.6 26.67,118.11 45.72,118.11 v46.99,116.84
  Bottom 0.61: v46.99,116.84 78.74,116.84 80.64,118.75 U6.7
IM3  (via drill 0.35)
  Top 0.61: J3.14 11.8,27.27 11.8,65.31 11.99,65.5 11.99,86.92 16.66,91.59 16.66,92.21 36.6,112.14 v42.93,112.14
  Bottom 0.61: v42.93,112.14 93.09,112.14 95.89,114.94 U7.7
IM4  (via drill 0.35)
  Top 0.61: J3.15 12.7,25.4 12.7,65.13 12.75,65.18 12.75,86.6 17.42,91.28 17.42,91.89 36.84,111.31 v41.91,111.31
  Bottom 0.61: v41.91,111.31 101.6,111.31 107.95,117.66 107.95,121.92 109.22,123.19 110.27,123.19 110.65,122.81 111.6,122.81 111.76,122.97 112.39,122.34 U8.7
IM5  (via drill 0.35)
  Top 0.61: J3.16 13.46,23.42 13.46,64.82 13.51,64.87 13.51,86.29 18.19,90.96 18.19,91.58 37.08,110.47 v40.64,110.47
  Bottom 0.61: v40.64,110.47 101.6,110.47 101.67,110.54 101.92,110.54 109.48,118.11 129.54,118.11 130.18,118.75 U9.7
IM6  (via drill 0.35)
  Top 0.61: J3.17 14.22,21.41 14.22,63.5 14.22,64.5 14.28,64.55 14.28,85.4 18.95,90.07 18.95,91.26 37.4,109.71 39.37,109.71 v39.37,109.64
  Bottom 0.61: v39.37,109.64 102.08,109.64 109.8,117.35 130.05,117.35 130.81,118.11 149.86,118.11 150.5,118.75 U10.7
IM7  (via drill 0.35)
  Top 0.61: J3.18 14.99,19.41 14.99,64.19 15.04,64.24 15.04,81.08 16.51,82.55 16.6,82.55 16.6,83.82 20.37,87.58 25.35,87.58 26.45,88.68 26.45,90.78 29.21,93.55 29.21,99.98 v38.1,108.87
  Bottom 0.61: v38.1,108.87 38.45,108.87 39.37,107.95 101.6,107.95 110.24,116.59 135.89,116.59 138.18,114.3 151.38,114.3 153.67,116.59 166.12,116.59 168.28,118.75 U11.7
IM8  (via drill 0.35)
  Top 0.457: J3.32 2.54,22.22 2.54,10.51 6.47,6.58 8.77,6.58 11.54,3.81 74.93,3.81 v76.2,2.54
  Top 0.61: v222.25,12.7 222.25,64.77 231.14,73.66 231.14,105.41 228.6,107.95 v217.17,107.95
  Bottom 0.61: v76.2,2.54 77.42,1.32 210.87,1.32 v222.25,12.7 | v217.17,107.95 212.09,107.95 208.28,111.76 200.66,111.76 194.31,118.11 185.42,118.11 184.78,118.75 U12.7
IM9  (via drill 0.35)
  Top 0.61: v223.52,105.41 228.6,105.41 229.87,104.14 229.87,74.93 221.11,66.17 221.11,35.69 187.2,1.78 80.96,1.78 77.66,5.08 11.24,5.08 9.05,7.26 7.97,7.26 3.81,11.43 3.81,20.75 J3.33
  Bottom 0.61: v223.52,105.41 222.25,105.41 210.82,116.84 203.2,116.84 201.29,118.75 U13.7
IM10  (via drill 0.35)
  Top 0.61: v228.6,102.87 228.6,74.93 220.34,66.67 220.34,37.47 185.42,2.54 81.41,2.54 77.98,5.97 11.43,5.97 9.37,8.03 8.48,8.03 4.96,11.55 4.96,19.13 J3.34
  Bottom 0.61: v228.6,102.87 219.07,112.39 U14.7
LED1
  Top 0.61: U$7.1 105.41,109.22 R2.1
LED2
  Top 0.61: U$7.2 121.92,109.86 R3.1
LED3
  Top 0.61: R4.1 125.73,119.38 U$7.3
LED4
  Top 0.61: U$7.4 133.97,108.66 140.53,115.22 140.53,120.22 R5.1
LED5
  Top 0.61: R6.1 143.51,106.7 U$7.5
LED6
  Top 0.61: U$8.1 151.13,113.03 R7.1
LED7
  Top 0.61: U$8.2 159.38,118.74 R8.1
LED8
  Top 0.61: U$8.3 175.12,112.9 175.12,119.05 175.26,119.19 R9.1
LED9
  Top 0.61: U$8.4 175.88,118.73 R10.1
LED10
  Top 0.61: R11.1 191.77,113.05 U$8.5
LJ-A  (via drill 0.35)
  Top 0.61: v34.29,90.17 34.27,90.19 K11.A1 | v229.87,69.85 229.87,66.51 223.14,59.78 223.14,57.36 226.06,54.44 226.06,46.07 J2.13
  Bottom 0.61: v34.29,90.17 45.39,79.07 45.39,75.54 49.3,71.63 66.36,71.63 70.93,76.2 227.33,76.2 229.87,73.66 v229.87,69.85
LJ-B  (via drill 0.35)
  Top 0.61: J2.15 227.48,55.86 231.9,60.28 231.9,76.96 v232.41,77.47 | v27.94,95.25 25.4,92.71 22.86,92.71 20.38,90.23 K11.A2
  Bottom 0.61: v232.41,77.47 71.12,77.47 66.04,72.39 49.62,72.39 46.16,75.85 46.16,80.84 31.75,95.25 v27.94,95.25
LJ-OUT  (via drill 0.35)
  Top 0.61: v24.13,10.16 J1.1
  Bottom 0.61: C17.2 28.77,116.42 K11.14.1 K11.14.2 19.49,115.53 15.39,119.63 5.21,119.63 1.45,115.88 1.45,22.68 5.29,18.84 6.71,18.84 7.7,17.86 7.7,13.05 8.79,11.96 16.06,11.96 17.47,10.54 23.75,10.54 v24.13,10.16
N$1
  Top 0.61: K1.12.1 K1.12.2
N$2
  Bottom 0.305: RN3.5 21,69.17 22.8,67.38 U1.9
N$3
  Top 0.61: K2.12.1 K2.12.2
N$4
  Top 0.61: K3.12.1 65.94,41.91 58.42,41.91 58.46,41.95 K3.12.2
N$5
  Bottom 0.457: D1.C 64.43,88.25 I$1.P$1 53.65,86.05 52.5,87.2 U2.2
N$6
  Top 0.61: K4.12.1 K4.12.2
N$7
  Top 0.61: K5.12.1 K5.12.2
N$8
  Top 0.61: K6.12.1 K6.12.2
N$9
  Bottom 0.61: K7.12.1 K7.12.2
N$10
  Bottom 0.305: RN4.5 86.3,67.9 U3.9
N$11
  Bottom 0.61: K8.12.1 K8.12.2
N$12
  Bottom 0.61: K9.12.1 K9.12.2
N$13
  Bottom 0.61: K10.12.1 K10.12.2
N$14
  Bottom 0.305: RN5.5 144.72,66.63 U4.9
N$15
  Bottom 0.61: K11.12.1 K11.12.2
N$16  (via drill 0.35)
  Bottom 0.457: v58.42,88.9 57.52,88.9 C1.1
REL1A
  Bottom 0.305: RN8.8 24.13,55.28
  Bottom 0.61: U1.16 24.13,56.45 24.13,55.88 24.13,55.28 24.13,30.44 K1.A1 27.88,21.59 32.2,17.27 53.11,17.27 54.56,15.82 72.55,15.82 75.23,13.13 207.48,13.13 224.64,30.29 J2.1
REL1B  (via drill 0.35)
  Top 0.61: K1.A2 20.38,39.92 18.95,41.36 18.95,52.62 20.32,53.99 20.32,55.88 23.5,59.05 v24.51,59.05
  Bottom 0.305: RN8.7 20.72,57.93 21.84,59.05 U1.15
  Bottom 0.61: J2.2 226.06,33.64 226.06,30.48 207.65,12.06 20.11,12.06 18.2,13.97 18.2,17.78 20.38,19.96 K1.A2 | v24.51,59.05 U1.15
REL2A
  Bottom 0.305: RN8.6 19.92,58.66 21.59,60.33 U1.14
  Bottom 0.61: U1.14 24.77,60.33 25.4,59.69 25.4,31.75 35.56,21.59 44.45,21.59 | 44.45,21.59 46.93,24.07 K2.A1 | J2.3 223.87,37.03 223.82,37.03 222.25,35.46 222.25,29.21 207.01,13.97 78.24,13.97 75.19,17.02 62.23,17.02 60.45,18.8 47.24,18.8 44.45,21.59
REL2B
  Bottom 0.305: U1.13 20.95,61.59 19.43,60.07 19.43,57.15 19.12,56.84 RN8.5
  Bottom 0.61: K2.A2 26.45,39.67 26.45,59.91 24.77,61.59 U1.13 | K2.A2 39.37,26.75 | K2.A2 39.43,25.88 41.32,23.99 43.47,23.99 45.07,25.58 45.07,27.29 46.99,29.21 48.26,29.21 50.04,27.43 50.04,23.81 54.29,19.56 60.96,19.56 62.74,17.78 75.51,17.78 78.42,14.86 206.63,14.86 221.49,29.72 221.49,35.78 222.25,36.54 222.25,38.15 J2.4
REL3A
  Bottom 0.305: U1.12 21.72,62.87 20.5,64.08 20.5,65.58 20.3,65.79 20.3,66.06 17.85,68.51 RN3.8
  Bottom 0.61: U1.12 24.77,62.87 34.04,53.59 49.28,53.59 50.8,52.07 50.8,24.13 54.61,20.32 62.23,20.32 63.5,19.05 66.04,19.05 | J2.5 224.64,42.25 221.49,39.1 221.49,36.85 220.73,36.09 220.73,30.03 206.32,15.62 78.74,15.62 75.31,19.05 66.04,19.05 | K3.A1 66.04,26.63 66.04,19.05
REL3B
  Bottom 0.305: RN3.7 18.65,68.59 20.75,66.49 20.75,65.98 20.95,65.77 20.95,65.28 22.1,64.14 U1.11
  Bottom 0.61: U1.11 24.77,64.14 34.29,54.61 49.72,54.61 52.07,52.26 52.07,30.56 55.92,26.71 58.46,26.71 K3.A2 58.48,26.77 60.96,29.25 67.27,29.25 80.01,16.51 206.12,16.51 219.96,30.35 219.96,36.41 220.22,36.66 220.22,39.94 223.43,43.15 223.43,43.78 224.64,44.99 J2.6
REL4A
  Bottom 0.305: RN3.6 19.45,68.43 21.21,66.67 21.21,66.17 21.97,65.41 U1.10
  Bottom 0.61: U1.10 26.04,65.41 36.07,55.37 50.92,55.37 52.83,53.46 52.83,33.02 55.37,30.48 67.31,30.48 76.2,21.59 79.93,21.59 | 79.93,21.59 82.47,21.59 86.79,17.27 205.81,17.27 219.2,30.66 219.2,36.72 219.46,36.98 219.46,40.25 222.25,43.05 222.25,46.37 J2.7 | K4.A1 79.93,21.59
REL4B
  Bottom 0.305: RN1.8 83.44,50.87
  Bottom 0.61: U3.16 85.72,56.52 83.44,54.23 83.44,50.87 83.44,29.21 | J2.8 220.98,47.84 220.98,43.18 218.44,40.64 218.44,30.98 205.49,18.03 93.73,18.03 87.63,24.13 87.63,27.94 86.36,29.21 83.44,29.21 | 78.78,27.94 K4.A2 80.05,29.21 83.44,29.21
REL5A
  Bottom 0.305: RN1.7 82.15,51.67 82.83,52.35 82.83,54.48 84.71,56.36 84.71,57.15 85.34,57.78 U3.15
  Bottom 0.61: U3.15 88.27,57.78 88.9,57.15 88.9,25.4 91.95,22.35 102.36,22.35 102.87,22.86 | 102.87,22.86 104.08,24.07 | 104.08,24.07 K5.A1 | 104.14,24.13 104.08,24.07 | J2.9 226.27,34.9 226.27,36.93 227.3,37.96 227.98,37.96 229.87,39.85 229.87,52.07 228.6,53.34 223.52,53.34 217.17,46.99 217.17,31.75 204.22,18.8 106.93,18.8 102.87,22.86
REL5B
  Bottom 0.305: RN1.6 82.06,52.47 82.37,52.78 82.37,54.67 84.2,56.5 84.2,58.17 85.09,59.05 U3.14
  Bottom 0.61: U3.14 88.27,59.05 90.17,57.15 90.17,30.56 91.52,29.21 96.52,29.21 | J2.10 228.25,37.2 228.3,37.2 231.14,40.04 231.14,52.07 228.6,54.61 223.52,54.61 215.9,46.99 215.9,31.75 203.71,19.56 111.25,19.56 105.92,24.89 105.92,27.94 104.65,29.21 99.06,29.21 96.52,29.21 | 96.52,29.21 96.58,29.15 K5.A2
REL6A
  Bottom 0.305: RN1.5 80.69,53.76 83.57,56.64 83.57,59.31 84.58,60.33 U3.13
  Bottom 0.61: U3.13 100.97,60.33 106.68,54.61 106.68,26.67 110.87,22.48 118.92,22.48 K6.A1
REL6B
  Bottom 0.305: RN4.8 82.62,65.97 82.96,65.63 82.96,64.09 85.46,61.59 U3.12
  Bottom 0.61: K6.A2 107.95,34.37 107.95,54.61 100.97,61.59 U3.12
REL7A
  Bottom 0.305: RN4.7 83.42,64.28 84.84,62.87 U3.11
  Bottom 0.61: U3.11 103.7,62.87 109.73,56.83 109.73,46.67 114.2,42.2 114.2,41.36 119.06,36.49 120.31,36.49 134.33,22.48 137.97,22.48 K7.A1
REL7B
  Bottom 0.305: RN4.6 84.22,64.75 84.84,64.14 U3.10
  Bottom 0.61: K7.A2 120.06,41.31 118.29,41.31 116.22,43.38 115.04,43.38 114.83,43.18 114.3,43.18 110.49,46.98 110.49,57.15 103.5,64.14 U3.10
REL8A
  Bottom 0.305: RN2.8 140.29,51.48 141.02,50.75 142.71,50.75 142.76,50.8 147.32,50.8
  Bottom 0.61: 145.41,55.24 U4.16 147.32,52.64 147.32,51.48 147.32,50.8 147.32,29.21 153,23.54 158.07,23.54 K8.A1
REL8B
  Bottom 0.305: RN2.7 138.83,52.22 139.57,52.96 140.97,52.96 141.35,53.34 141.86,53.34 143,54.48 143,55.5 144.02,56.52 U4.15
  Bottom 0.61: K8.A2 148.08,32.34 148.08,55.12 146.69,56.52 U4.15
REL9A
  Bottom 0.305: RN2.6 138.03,52.43 139.4,53.8 141.6,53.8 142.49,54.69 142.49,56.77 143.51,57.78 U4.14
  Bottom 0.61: U4.14 159.38,57.78 165.1,52.07 165.1,24.13 166.75,22.48 176.07,22.48 K9.A1
REL9B
  Bottom 0.305: U4.13 143.64,59.05 141.91,57.33 141.91,55.08 141.18,54.36 139.19,54.36 137.23,52.39 RN2.5
  Bottom 0.61: K9.A2 166.37,33.1 166.37,51.88 159.19,59.05 U4.13
REL10A
  Bottom 0.305: RN5.8 141.04,66.72 142.24,65.52 142.24,61.59 143.51,60.33 144.78,60.33
  Bottom 0.61: U4.12 144.78,60.33 173.35,60.33 182.88,50.8 182.88,27.94 188.34,22.48 195.12,22.48 K10.A1 199.39,26.75
REL10B
  Bottom 0.305: RN5.7 141.84,66.57 142.75,65.66 142.75,62.23 143.38,61.59 U4.11
  Bottom 0.61: U4.11 174.62,61.59 185.42,50.8 185.42,33.1 K10.A2
RTN  (via drill 0.35)
  Top 0.457: v54.61,45.72 52.07,45.72 v49.53,48.26
  Top 0.61: v91.44,49.53 v76.2,49.53 | v113.03,49.53 v105.41,49.53 | v77.47,115.57 v77.47,118.11 | v138.43,123.19 v138.43,120.65 138.43,116.84 v139.7,115.57 | v71.12,120.65 71.12,123.19 v72.39,124.46 | J5.8 4.64,97.34 2.67,99.31 2.67,108.2 4.14,109.67 J5.11 | J3.19 7.62,12.14 7.62,30 J3.30
  Top 0.813: v27.94,49.53 v20.32,49.53
  Top 1.219: U$3.4 96.54,137.16 99.2,139.83 101.42,139.83 104.08,137.16 U$4.1 113.7,137.16 116.36,139.83 118.58,139.83 121.24,137.16 U$4.3 130.2,137.16 132.87,139.83 135.07,139.83 137.74,137.16 U$4.5 151.17,137.16 153.84,139.83 156.04,139.83 158.71,137.16 U$5.2 167.67,137.16 170.34,139.83 172.54,139.83 175.21,137.16 U$5.4 184.17,137.16 186.84,139.83 189.04,139.83 191.71,137.16 U$6.1 201.33,137.16 204,139.83 206.21,139.83 208.87,137.16 U$6.3 217.83,137.16 220.5,139.83 222.71,139.83 225.37,137.16 U$6.5
  Bottom 0.305: C9.1 92.29,46.99 91.44,46.99 v91.44,49.53
  Bottom 0.457: C7.1 v54.61,45.72 | v27.94,49.53 30.06,47.41 C6.1 37.93,47.41 38.87,48.35 47.49,48.35 47.58,48.26 v49.53,48.26
  Bottom 0.61: U6.5 83.19,118.75 80.01,115.57 v77.47,115.57 | 142.22,126.98 v138.43,123.19 | 152.52,119.59 148.5,115.57 v139.7,115.57 | U5.5 71.05,120.72 v71.12,120.65 | v113.03,49.53 113.45,49.11 113.45,48.26 112.6,47.41 C11.1
  pour Bottom (rank 4): -1.27,152.4 237.49,152.4 237.49,-2.54 -1.27,-2.54
VCC  (via drill 0.35)
  Top 0.305: v105.41,121.92 v109.91,121.92
  Top 0.457: J4.2 17.15,113.72 K11.11.2
  Bottom 0.305: U5.8 64.14,122.17 64.26,122.3 77.79,122.3 | 77.79,122.3 U6.8 | 77.79,122.3 93.03,122.3 | 93.03,122.3 U7.8 | 93.03,122.3 105.03,122.3 v105.41,121.92 | v109.91,121.92 111.11,120.72 U8.8 111.12,119.38 111.78,118.72 126.91,118.72 U9.8 128.91,121.79 129.41,122.3 147.64,122.3 147.67,122.27 | 147.67,122.27 U10.8 | 147.67,122.27 165.45,122.27 | U11.8 165.45,122.27 | 165.45,122.27 181.96,122.27 | 181.96,122.27 U12.8 | 181.96,122.27 198.47,122.27 | 198.47,122.27 U13.8 | 198.47,122.27 216.25,122.27 U14.8
  Bottom 0.457: K11.11.2 K11.11.1 | K11.11.1 38.1,110.49 46.99,119.38 62.8,119.38 U5.8 | K11.11.1 43.18,95.19 43.18,87.63 44.45,86.36 48.26,86.36 | 48.26,86.36 49.1,87.2 U2.4 | 48.26,86.36 49.53,86.36 C2.1 | 62.23,79.64 I$1.P$2 62.23,78.74
  Bottom 0.61: C2.1 C3.1 C4.1 C5.1 62.23,79.64
VCC_IN  (via drill 0.35)  (1 unrouted)
  Top 0.61: v57.15,121.92 v57.15,105.41
  Bottom 0.61: v57.15,121.92 50.8,128.27 30.48,128.27 26.67,132.08 21.59,137.16 13.97,137.16 J4.1 | 54.11,89.96 54.14,89.96 54.36,90.17 54.36,90.55 57.15,93.34 v57.15,105.41
VM1  (via drill 0.35)
  Top 0.457: v49.53,8.89 52.72,12.08 J1.4
  Bottom 0.457: J3.35 6.2,16.5 4.43,14.73 4.43,11.36 9.54,6.24 43.18,6.24 44.45,6.24 44.6,6.24 47.25,8.89 v49.53,8.89
VM2  (via drill 0.35)
  Top 0.61: v59.94,9.4 62.25,11.7 J1.5
  Bottom 0.457: J3.36 6.2,13.73 5.04,12.57 5.04,11.61 9.8,6.85 44.35,6.85 47.32,9.83 59.52,9.83 v59.94,9.4
VM3  (via drill 0.35)
  Top 0.457: v69.85,8.89 69.85,12.04 J1.6
  Bottom 0.305: J3.37 6.35,11.94
  Bottom 0.457: J3.37 7.88,10.41 7.88,10.24 10.66,7.46 44.09,7.46 47.25,10.62 68.12,10.62 v69.85,8.89
VOUT1  (via drill 0.35)
  Top 1.372: K1.14.2 K1.14.1 38.1,62.25 38.1,105.28 56.52,123.7 v64.14,123.7 v65.41,123.7
  Bottom 0.305: K1.14.2 19.43,52.03 C10.2
  Bottom 1.372: v64.14,123.7 U5.1 | v65.41,123.7 U5.2
VOUT1!
  Top 0.61: R2.2 76.2,128.27 U$3.1
  pour Bottom (isolate 0.305, rank 2): 67.31,123.19 71.12,123.19 71.12,140.97 63.5,140.97 63.5,123.19
VOUT2  (via drill 0.35)
  Top 1.372: K2.14.2 K2.14.1 79.38,84.47 v79.38,123.83 v80.64,123.83
  Bottom 0.305: C6.2 38.48,52.03 K2.14.2
  Bottom 1.372: v79.38,123.83 U6.1 | v80.64,123.83 U6.2
VOUT2!
  Top 0.61: R3.2 106.99,128.27 105.87,129.39 95.4,129.39 95.25,129.54 91.43,129.54 U$3.3
  pour Bottom (isolate 0.305, rank 2): 81.28,123.19 87.63,123.19 87.63,140.97 80.01,140.97 78.74,140.97 78.74,123.19
VOUT3  (via drill 0.35)
  Top 1.372: K3.14.2 K3.14.1 94.61,80.67 v94.61,123.95 v95.89,123.95
  Bottom 0.305: C7.2 57.53,52.03 K3.14.2
  Bottom 1.372: v94.61,123.95 U7.1 | v95.89,123.95 U7.2
VOUT3!
  Top 0.61: R4.2 123.5,128.27 122.38,129.39 108.08,129.39 U$3.5
  pour Bottom (isolate 0.305, rank 2): 96.52,123.19 100.33,123.19 100.33,125.73 104.14,129.54 104.14,140.97 96.52,140.97 96.52,132.08 93.98,129.54 93.98,123.19
VOUT4  (via drill 0.35)
  Top 1.372: K4.14.2 K4.14.1 111.12,78.12 111.12,96.52 113.03,98.42 113.03,123.32 v112.39,123.95 v111.12,123.95
  Bottom 0.305: C8.2 76.58,52.03 K4.14.2
  Bottom 1.372: v111.12,123.95 U8.1 | v112.39,123.95 U8.2
VOUT4!
  Top 0.61: R5.2 126.36,128.27 U$4.2
  pour Bottom (isolate 0.305, rank 2): 110.49,123.19 116.84,123.19 116.84,125.73 121.92,130.81 121.92,140.97 113.03,140.97 113.03,132.08 110.49,129.54
VOUT5  (via drill 0.35)
  Top 1.372: K5.14.2 96.62,52.07 104.14,52.07 104.1,52.03 K5.14.1 128.91,76.86 v128.91,123.83 v130.18,123.83
  Bottom 0.305: C9.2 95.63,52.03 K5.14.2
  Bottom 1.372: v128.91,123.83 U9.1 | U9.2 v130.18,123.83
VOUT5!
  Top 0.61: R6.2 134.62,137.16 U$4.4
  pour Bottom (isolate 0.305, rank 2): 130.81,123.19 134.62,123.19 134.62,125.73 138.43,129.54 138.43,137.16 138.43,140.97 129.54,140.97 129.54,132.08 128.27,130.81 128.27,123.19
VOUT6  (via drill 0.35)
  Top 1.372: K6.14.2 K6.14.1 140.97,69.87 140.97,95.25 146.05,100.33 146.05,111.12 149.22,114.3 v149.22,123.83
  Bottom 0.305: 115.57,52.03 K6.14.2
  Bottom 0.61: C11.2 111.76,50.8 112.99,52.03 115.57,52.03
  Bottom 1.372: U10.1 v149.22,123.83 150.5,123.83 U10.2
VOUT6!
  Top 0.61: R7.2 154.94,132.08 U$5.1
  pour Bottom (isolate 0.305, rank 2): 151.13,123.19 154.94,123.19 154.94,125.73 158.75,129.54 158.75,140.97 151.13,140.97 151.13,130.81 148.59,128.27 148.59,123.19
VOUT7  (via drill 0.35)
  Top 1.372: K7.14.2 K7.14.1 161.29,71.14 161.29,103.44 162.12,104.27 162.12,110.69 167,115.57 v167,123.7 v168.28,123.7
  Bottom 0.305: K7.14.2 133.73,52.03 C12.2
  Bottom 1.372: v167,123.7 U11.1 | U11.2 v168.28,123.7
VOUT7!
  Top 0.61: R8.2 162.55,128.27 U$5.3
  pour Bottom (isolate 0.305, rank 2): 168.91,123.19 172.72,123.19 172.72,125.73 175.26,128.27 175.26,135.89 175.26,140.97 167.64,140.97 167.64,129.54 166.37,128.27 166.37,123.19
VOUT8  (via drill 0.35)
  Top 1.372: K8.14.2 K8.14.1 178.82,69.62 178.82,118.87 v183.51,123.57 v184.78,123.57
  Bottom 0.305: K8.14.2 152.78,52.03 C13.2
  Bottom 1.372: v183.51,123.57 U12.1 | U12.2 v184.78,123.57
VOUT8!
  Top 0.61: R9.2 176.22,128.27 177.34,129.39 180.17,129.39 U$5.5
  pour Bottom (isolate 0.305, rank 2): 185.42,123.19 189.23,123.19 189.23,125.73 191.77,128.27 191.77,140.97 184.15,140.97 184.15,129.54 182.88,128.27 182.88,123.19
VOUT9  (via drill 0.35)
  Top 1.372: K9.14.2 172.82,52.07 180.34,52.07 180.3,52.03 K9.14.1 196.85,68.6 196.85,120.4 v200.03,123.57 v201.29,123.57
  Bottom 0.305: K9.14.2 171.83,52.03 C14.2
  Bottom 1.372: v200.03,123.57 U13.1 | U13.2 v201.29,123.57
VOUT9!
  Top 0.61: R10.2 190.19,128.27 191.31,129.39 197.33,129.39 U$6.2
  pour Bottom (isolate 0.305, rank 2): 201.93,123.19 205.74,123.19 205.74,125.73 208.28,128.27 208.28,140.97 201.93,140.97 200.66,140.97 200.66,129.54 199.39,128.27 199.39,123.19
VOUT10  (via drill 0.35)
  Top 1.372: K10.14.2 K10.14.1 214.63,67.33 214.63,110.49 217.81,113.67 v217.81,123.7 v219.07,123.7
  Bottom 0.305: K10.14.2 190.88,52.03 C15.2
  Bottom 1.372: v217.81,123.7 U14.1 | U14.2 v219.07,123.7
VOUT10!
  Top 0.61: R11.2 212.71,128.27 U$6.4
  pour Bottom (isolate 0.305, rank 2): 219.71,123.19 223.52,123.19 223.52,125.73 226.06,128.27 226.06,140.97 218.44,140.97 218.44,129.54 217.17,128.27 217.17,123.19
VS1
  Top 1.372: U$1.1 82.55,7.62 43.69,7.62 31.75,19.56 31.75,43.18 27.94,46.99 K1.11.1 K1.11.2
VS2
  Top 1.372: U$1.2 92.71,5.08 63.5,34.29 53.34,34.29 50.8,36.83 50.8,43.18 46.99,46.99 K2.11.1 K2.11.2
VS3
  Top 1.372: U$1.3 101.59,13.98 68.58,46.99 K3.11.1 K3.11.2
VS4
  Top 1.372: U$1.4 109.84,24.78 87.63,46.99 K4.11.1 K4.11.2
VS5
  Top 1.372: U$1.5 118.09,20.34 109.22,29.21 109.22,41.91 104.14,46.99 K5.11.1 K5.11.2
VS6
  Top 1.372: U$2.1 127,43.12 K6.11.1 K6.11.2
VS7
  Top 1.372: U$2.2 130.81,9.52 130.81,43.18 134.62,46.99 K7.11.2 K7.11.1
VS8
  Top 1.372: U$2.3 143.5,21.58 148.59,26.67 148.59,41.91 153.67,46.99 K8.11.2 K8.11.1
VS9  (1 unrouted)
  Top 1.372: U$2.4 167.64,20.97 167.64,41.91 172.72,46.99 | K9.11.2 K9.11.1
VS10
  Top 1.372: U$2.5 170.18,5.08 186.69,21.59 186.69,41.91 191.77,46.99 K10.11.2 K10.11.1
(copper drawn outside any net)
  shapes: Top area x4

### Text on the board
tPlace: VOut1 | VCCIN | VCC | BAT+ | RTN | RTN | RTN | RTN | RTN | RTN | RTN | RTN | RTN | RTN | RTN | VOut2 | VOut3 | VOut4 | VOut5 | VOut6 | VOut7 | VOut8 | VOut9 | VOut10 | GND | 2 | 3 | 4 | 5 | 6 | 7 | 8 | 9 | 10 | 1 | FRAME | LED1 | LED2 | LED3 | LED4 | LED5 | LED6 | LED7 | LED8 | LED9 | LED10 | LJ-DB15 | LJ-DB37 | Auxiliary Relay Control | VCC | GND | RTN | VM1 | VM2 | VM3 | VS1 | VS2 | VS3 | VS4 | VS5 | VS6 | VS7 | VS8 | VS9 | VS10 | T | erahertz | I | ntensity | M | apper | Justin Bracks / https://github.com/tim-balloon/tim-electronics